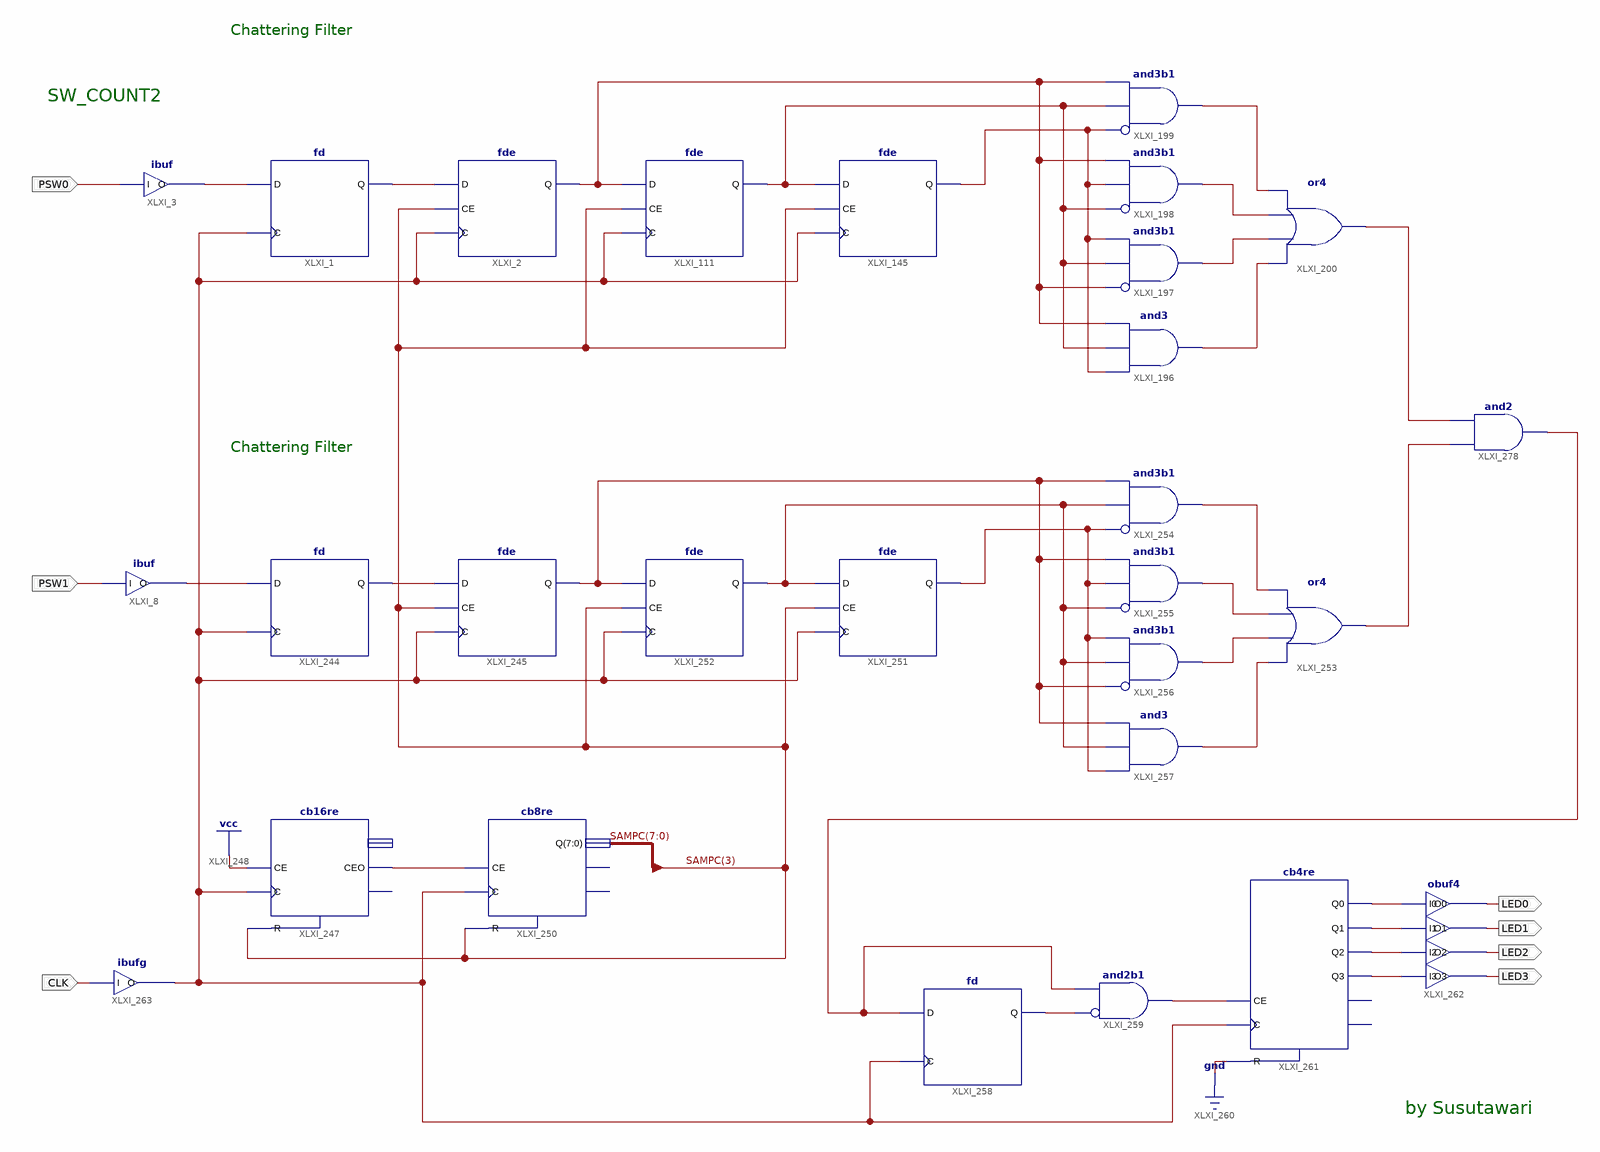
[diagram p0: schematic sheet 1]
// Xilinx ISE schematic SW_COUNT2.sch (spartan3a) as structural Verilog: 28 symbols, 7 ports
module SW_COUNT2 (
  input  CLK,
  input  PSW1,
  input  PSW0,
  output LED0,
  output LED1,
  output LED2,
  output LED3
);

  wire LA_CLK, LAA0, XLXN_773, XLXN_774, XLXN_775, XLXN_776, XLXN_782, XLXN_797, XLXN_945, XLXN_1212,
       XLXN_1216, XLXN_1218, XLXN_1219, XLXN_1220, XLXN_1222, XLXN_1224, XLXN_1225, XLXN_1226, XLXN_1227,
       XLXN_1235, XLXN_1236, XLXN_1245, XLXN_1246, XLXN_1247, XLXN_1248, XLXN_1255, XLXN_1286, XLXN_1287,
       XLXN_1288;
  wire [7:0] SAMPC;

  fd XLXI_244 (.C(LA_CLK), .D(XLXN_1219), .Q(XLXN_1218));
  fde XLXI_245 (.C(LA_CLK), .CE(SAMPC[3]), .D(XLXN_1218), .Q(XLXN_1255));
  cb16re XLXI_247 (.C(LA_CLK), .CE(1'b1), .R(SAMPC[3]), .CEO(XLXN_1216));  // open: Q, TC
  cb8re XLXI_250 (.C(LA_CLK), .CE(XLXN_1216), .R(SAMPC[3]), .Q(SAMPC));  // open: CEO, TC
  fde XLXI_251 (.C(LA_CLK), .CE(SAMPC[3]), .D(XLXN_1220), .Q(XLXN_1227));
  fde XLXI_252 (.C(LA_CLK), .CE(SAMPC[3]), .D(XLXN_1255), .Q(XLXN_1220));
  or XLXI_253 (XLXN_1288, XLXN_1222, XLXN_1224, XLXN_1225, XLXN_1226);
  and XLXI_254 (XLXN_1226, ~XLXN_1227, XLXN_1220, XLXN_1255);  // and3b1
  and XLXI_255 (XLXN_1225, ~XLXN_1220, XLXN_1227, XLXN_1255);  // and3b1
  and XLXI_256 (XLXN_1224, ~XLXN_1255, XLXN_1220, XLXN_1227);  // and3b1
  and XLXI_257 (XLXN_1222, XLXN_1227, XLXN_1220, XLXN_1255);
  fd XLXI_258 (.C(LA_CLK), .D(XLXN_1286), .Q(XLXN_1235));
  and XLXI_259 (XLXN_1236, ~XLXN_1235, XLXN_1286);  // and2b1
  cb4re XLXI_261 (
    .C(LA_CLK), .CE(XLXN_1236), .R(1'b0), .Q0(XLXN_1245), .Q1(XLXN_1246), .Q2(XLXN_1247), .Q3(XLXN_1248));  // open: CEO, TC
  obuf4 XLXI_262 (
    .I0(XLXN_1245), .I1(XLXN_1246), .I2(XLXN_1247), .I3(XLXN_1248), .O0(LED0), .O1(LED1), .O2(LED2), .O3(LED3));
  ibufg XLXI_263 (.I(CLK), .O(LA_CLK));
  fd XLXI_1 (.C(LA_CLK), .D(LAA0), .Q(XLXN_782));
  fde XLXI_2 (.C(LA_CLK), .CE(SAMPC[3]), .D(XLXN_782), .Q(XLXN_1212));
  ibuf XLXI_3 (.I(PSW0), .O(LAA0));
  fde XLXI_145 (.C(LA_CLK), .CE(SAMPC[3]), .D(XLXN_797), .Q(XLXN_945));
  fde XLXI_111 (.C(LA_CLK), .CE(SAMPC[3]), .D(XLXN_1212), .Q(XLXN_797));
  or XLXI_200 (XLXN_1287, XLXN_776, XLXN_775, XLXN_774, XLXN_773);
  and XLXI_199 (XLXN_773, ~XLXN_945, XLXN_797, XLXN_1212);  // and3b1
  and XLXI_198 (XLXN_774, ~XLXN_797, XLXN_945, XLXN_1212);  // and3b1
  and XLXI_197 (XLXN_775, ~XLXN_1212, XLXN_797, XLXN_945);  // and3b1
  and XLXI_196 (XLXN_776, XLXN_945, XLXN_797, XLXN_1212);
  and XLXI_278 (XLXN_1286, XLXN_1288, XLXN_1287);
  ibuf XLXI_8 (.I(PSW1), .O(XLXN_1219));

  // Notes on the sheet:
  //   Chattering Filter
  //   SW_COUNT2
  //   Chattering Filter
  //   by Susutawari
endmodule
